# Altium schematic sheet Codec's.SchDoc: {Наименование}
size 420 x 297 mm; DocumentNumber: ВКА.821011.000.ПЗ; PageSetup: Record=PageOptions|CenterHorizontal=False|CenterVertical=False|PrintScale=0.98|XCorrection=0.00|YCorrection=0.00|PrintKind=1|BorderSize=5000000|LeftOffset=0|BottomOffset=0|Orientation=2|PaperLength=4200|PaperWidth=2970|Scale=100|PaperSource=7|PrintQuality=600|MediaType=1|DitherType=10|PrintScaleMode=1|PaperKind=A3|PaperIndex=8; Rule: PcbType=ProtelPcb
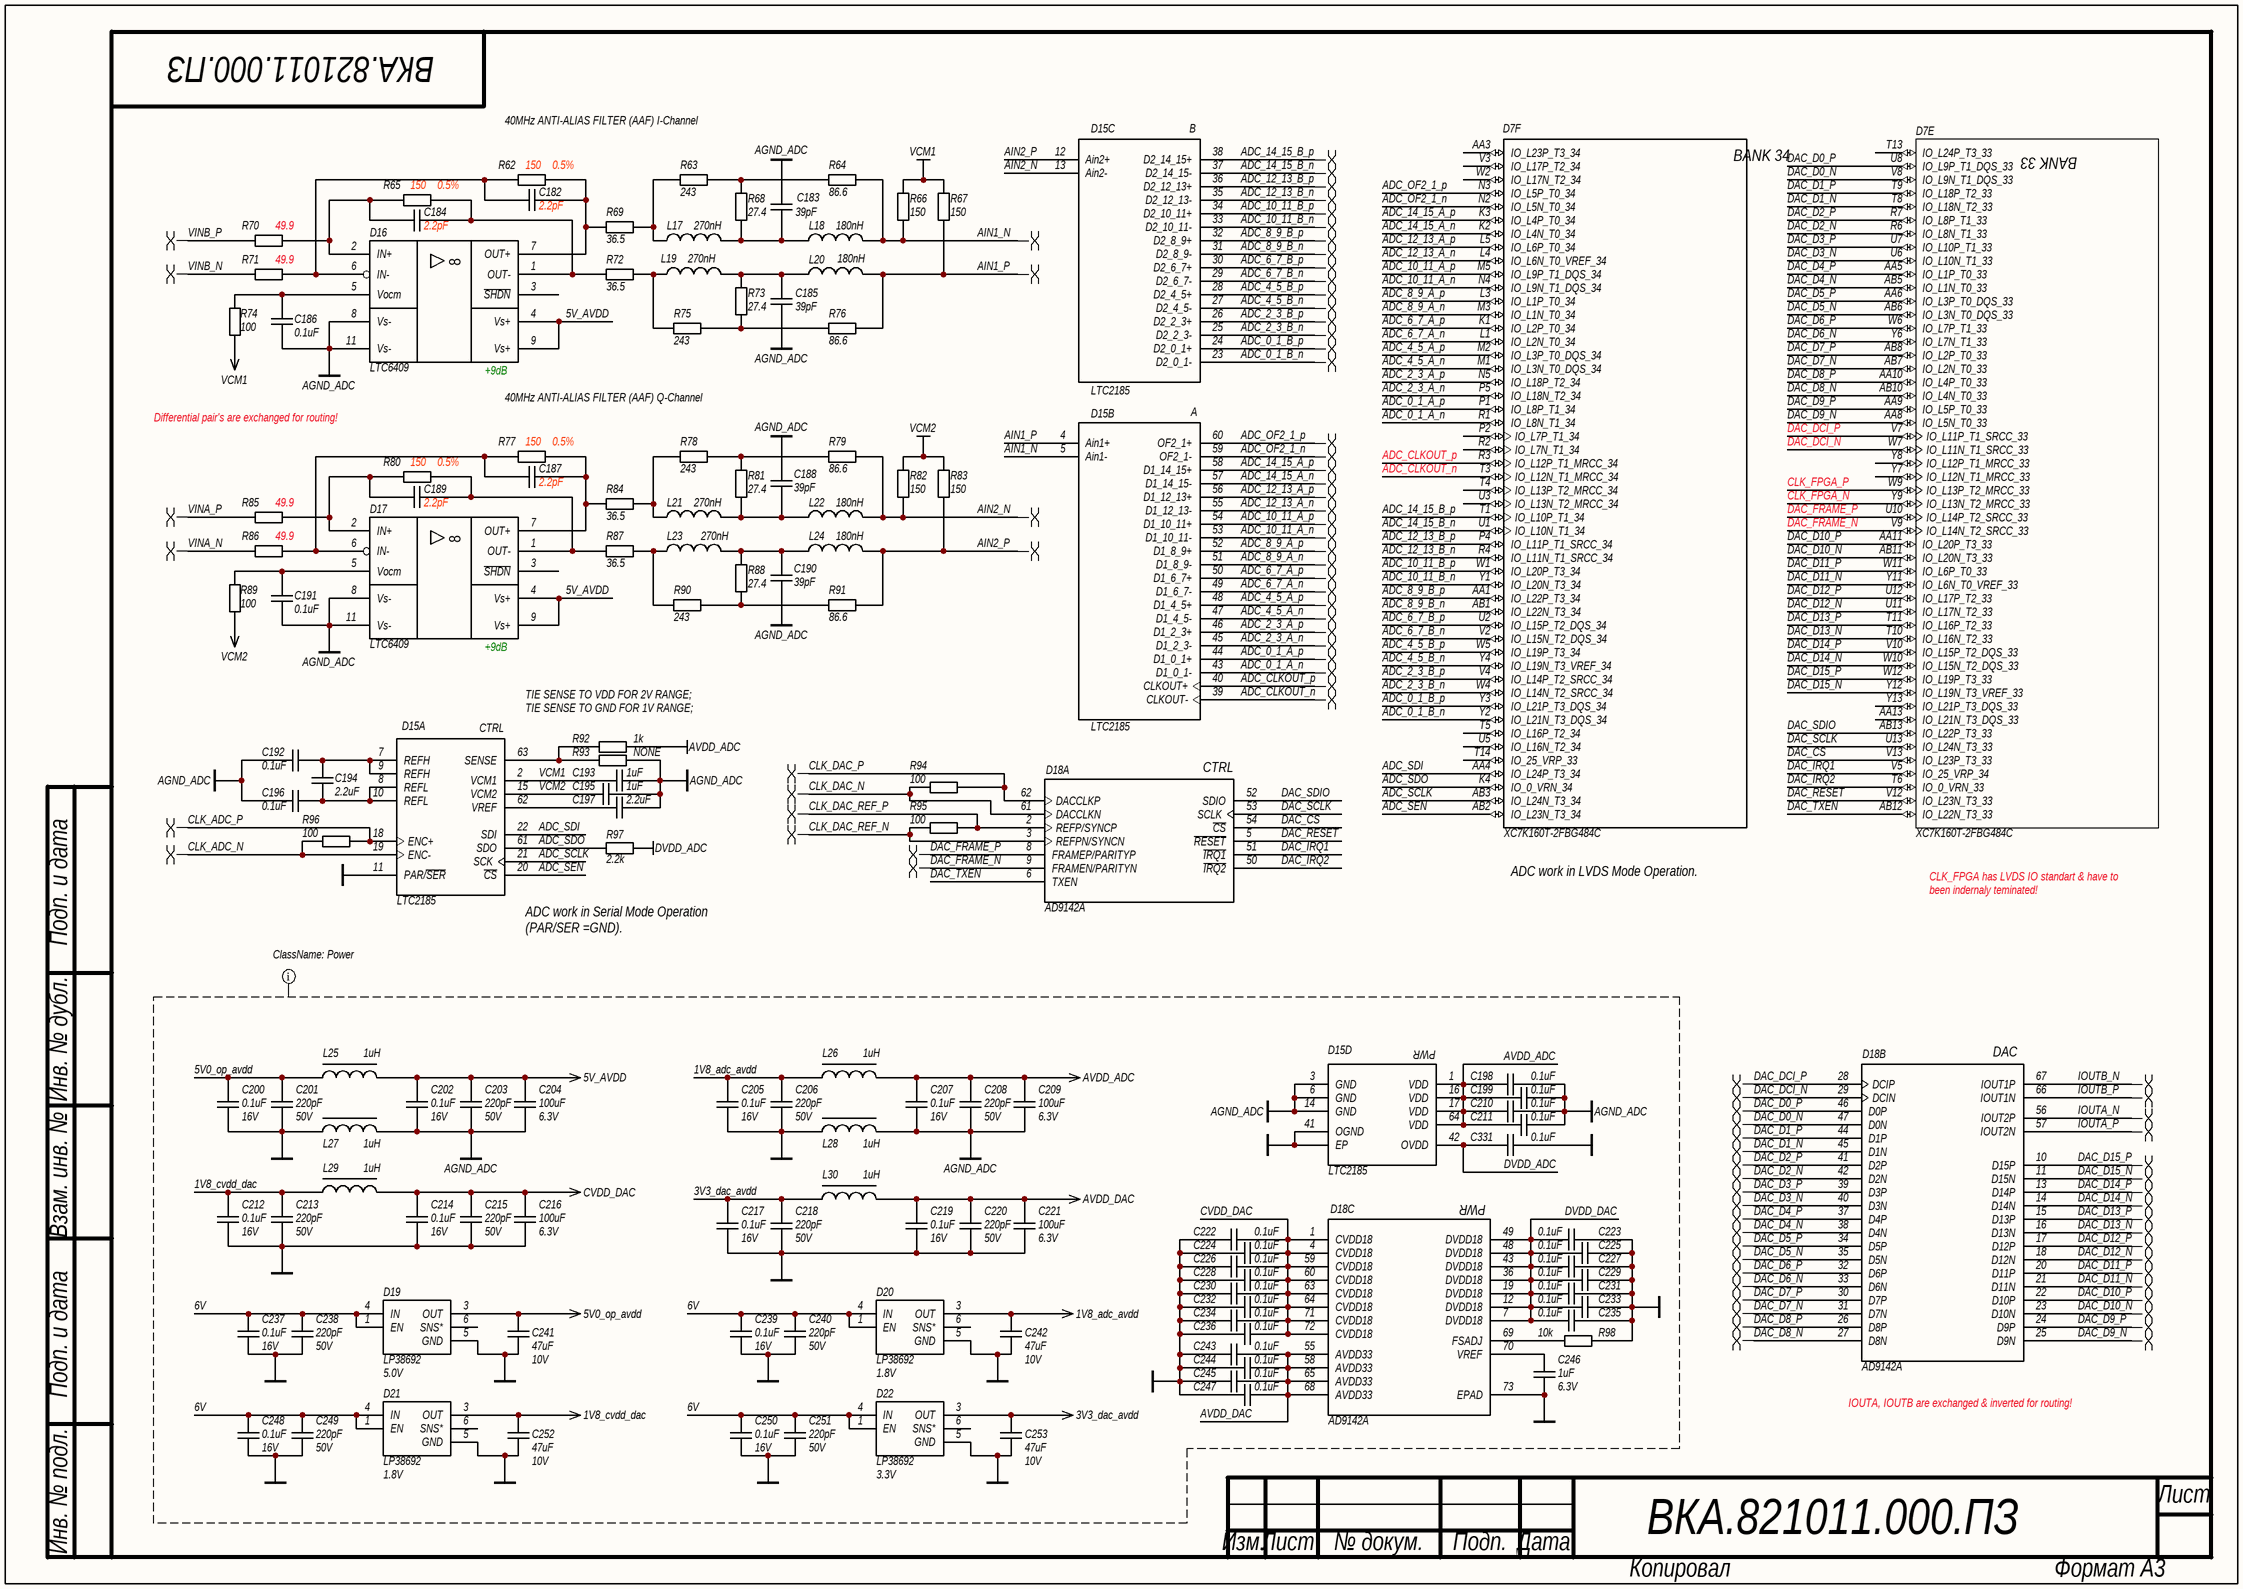
[diagram p0: Codec's.SchDoc]

## Parts
C182  value 2.2pF  [C0402]  (hidden comment: CAP)
C183  value 39pF  [C0402]  (hidden comment: CAP)
C184  value 2.2pF  [C0402]  (hidden comment: CAP)
C185  value 39pF  [C0402]  (hidden comment: CAP)
C186  value 0.1uF  [C0402]  (hidden comment: CAP)
C187  value 2.2pF  [C0402]  (hidden comment: CAP)
C188  value 39pF  [C0402]  (hidden comment: CAP)
C189  value 2.2pF  [C0402]  (hidden comment: CAP)
C190  value 39pF  [C0402]  (hidden comment: CAP)
C191  value 0.1uF  [C0402]  (hidden comment: CAP)
C192  value 0.1uF  [C0402]  (hidden comment: CAP)
C193  value 1uF  [C0402]  (hidden comment: CAP)
C194  value 2.2uF  [C0603]  (hidden comment: CAP)
C195  value 1uF  [C0402]  (hidden comment: CAP)
C196  value 0.1uF  [C0402]  (hidden comment: CAP)
C197  value 2.2uF  [C0603]  (hidden comment: CAP)
C198  value 0.1uF  [C0402]  (hidden comment: CAP)
C199  value 0.1uF  [C0402]  (hidden comment: CAP)
C200  value 0.1uF  Voltage: 16V  [C0603]  (hidden comment: CAP)
C201  value 220pF  Voltage: 50V  [C0603]  (hidden comment: CAP)
C202  value 0.1uF  Voltage: 16V  [C0603]  (hidden comment: CAP)
C203  value 220pF  Voltage: 50V  [C0603]  (hidden comment: CAP)
C204  value 100uF  Voltage: 6.3V  [C1210]  (hidden comment: CAP uF)
C205  value 0.1uF  Voltage: 16V  [C0603]  (hidden comment: CAP)
C206  value 220pF  Voltage: 50V  [C0603]  (hidden comment: CAP)
C207  value 0.1uF  Voltage: 16V  [C0603]  (hidden comment: CAP)
C208  value 220pF  Voltage: 50V  [C0603]  (hidden comment: CAP)
C209  value 100uF  Voltage: 6.3V  [C1210]  (hidden comment: CAP uF)
C210  value 0.1uF  [C0402]  (hidden comment: CAP)
C211  value 0.1uF  [C0402]  (hidden comment: CAP)
C212  value 0.1uF  Voltage: 16V  [C0603]  (hidden comment: CAP)
C213  value 220pF  Voltage: 50V  [C0603]  (hidden comment: CAP)
C214  value 0.1uF  Voltage: 16V  [C0603]  (hidden comment: CAP)
C215  value 220pF  Voltage: 50V  [C0603]  (hidden comment: CAP)
C216  value 100uF  Voltage: 6.3V  [C1210]  (hidden comment: CAP uF)
C217  value 0.1uF  Voltage: 16V  [C0603]  (hidden comment: CAP)
C218  value 220pF  Voltage: 50V  [C0603]  (hidden comment: CAP)
C219  value 0.1uF  Voltage: 16V  [C0603]  (hidden comment: CAP)
C220  value 220pF  Voltage: 50V  [C0603]  (hidden comment: CAP)
C221  value 100uF  Voltage: 6.3V  [C1210]  (hidden comment: CAP uF)
C222  value 0.1uF  [C0402]  (hidden comment: CAP)
C223  value 0.1uF  [C0402]  (hidden comment: CAP)
C224  value 0.1uF  [C0402]  (hidden comment: CAP)
C225  value 0.1uF  [C0402]  (hidden comment: CAP)
C226  value 0.1uF  [C0402]  (hidden comment: CAP)
C227  value 0.1uF  [C0402]  (hidden comment: CAP)
C228  value 0.1uF  [C0402]  (hidden comment: CAP)
C229  value 0.1uF  [C0402]  (hidden comment: CAP)
C230  value 0.1uF  [C0402]  (hidden comment: CAP)
C231  value 0.1uF  [C0402]  (hidden comment: CAP)
C232  value 0.1uF  [C0402]  (hidden comment: CAP)
C233  value 0.1uF  [C0402]  (hidden comment: CAP)
C234  value 0.1uF  [C0402]  (hidden comment: CAP)
C235  value 0.1uF  [C0402]  (hidden comment: CAP)
C236  value 0.1uF  [C0402]  (hidden comment: CAP)
C237  value 0.1uF  Voltage: 16V  [C0603]  (hidden comment: CAP)
C238  value 220pF  Voltage: 50V  [C0603]  (hidden comment: CAP)
C239  value 0.1uF  Voltage: 16V  [C0603]  (hidden comment: CAP)
C240  value 220pF  Voltage: 50V  [C0603]  (hidden comment: CAP)
C241  value 47uF  Voltage: 10V  [C1210]  (hidden comment: CAP uF)
C242  value 47uF  Voltage: 10V  [C1210]  (hidden comment: CAP uF)
C243  value 0.1uF  [C0402]  (hidden comment: CAP)
C244  value 0.1uF  [C0402]  (hidden comment: CAP)
C245  value 0.1uF  [C0402]  (hidden comment: CAP)
C246  value 1uF  Voltage: 6.3V  [C0402]  (hidden comment: CAP)
C247  value 0.1uF  [C0402]  (hidden comment: CAP)
C248  value 0.1uF  Voltage: 16V  [C0603]  (hidden comment: CAP)
C249  value 220pF  Voltage: 50V  [C0603]  (hidden comment: CAP)
C250  value 0.1uF  Voltage: 16V  [C0603]  (hidden comment: CAP)
C251  value 220pF  Voltage: 50V  [C0603]  (hidden comment: CAP)
C252  value 47uF  Voltage: 10V  [C1210]  (hidden comment: CAP uF)
C253  value 47uF  Voltage: 10V  [C1210]  (hidden comment: CAP uF)
C331  value 0.1uF  [C0402]  (hidden comment: CAP)
D7  XC7K160T-2FBG484C  [FBG484]  (parts E,F of 12)
D15  LTC2185  [QFN-64]  (parts A,B,C,D of 4)
D16  LTC6409  [QFN-10]
D17  LTC6409  [QFN-10]
D18  AD9142A  [LFCSP_VQ-72]  (parts A,B,C of 3)
D19  LP38692  Voltage: 5.0V  [SOT-223-5]
D20  LP38692  Voltage: 1.8V  [SOT-223-5]
D21  LP38692  Voltage: 1.8V  [SOT-223-5]
D22  LP38692  Voltage: 3.3V  [SOT-223-5]
L17  value 270nH  [L0603]  (hidden comment: Inductor RF)
L18  value 180nH  [L0603]  (hidden comment: Inductor RF)
L19  value 270nH  [L0603]  (hidden comment: Inductor RF)
L20  value 180nH  [L0603]  (hidden comment: Inductor RF)
L21  value 270nH  [L0603]  (hidden comment: Inductor RF)
L22  value 180nH  [L0603]  (hidden comment: Inductor RF)
L23  value 270nH  [L0603]  (hidden comment: Inductor RF)
L24  value 180nH  [L0603]  (hidden comment: Inductor RF)
L25  value 1uH  [L1210_Murata]  (hidden comment: Inductor LF)
L26  value 1uH  [L1210_Murata]  (hidden comment: Inductor LF)
L27  value 1uH  [L1210_Murata]  (hidden comment: Inductor LF)
L28  value 1uH  [L1210_Murata]  (hidden comment: Inductor LF)
L29  value 1uH  [L1210_Murata]  (hidden comment: Inductor LF)
L30  value 1uH  [L1210_Murata]  (hidden comment: Inductor LF)
R62  value 150  Tolerance: 0.5%  [R0402]  (hidden comment: RES)
R63  value 243  [R0402]  (hidden comment: RES)
R64  value 86.6  [R0402]  (hidden comment: RES)
R65  value 150  Tolerance: 0.5%  [R0402]  (hidden comment: RES)
R66  value 150  [R0402]  (hidden comment: RES)
R67  value 150  [R0402]  (hidden comment: RES)
R68  value 27.4  [R0402]  (hidden comment: RES)
R69  value 36.5  [R0402]  (hidden comment: RES)
R70  value 49.9  [R0402]  (hidden comment: RES)
R71  value 49.9  [R0402]  (hidden comment: RES)
R72  value 36.5  [R0402]  (hidden comment: RES)
R73  value 27.4  [R0402]  (hidden comment: RES)
R74  value 100  [R0402]  (hidden comment: RES)
R75  value 243  [R0402]  (hidden comment: RES)
R76  value 86.6  [R0402]  (hidden comment: RES)
R77  value 150  Tolerance: 0.5%  [R0402]  (hidden comment: RES)
R78  value 243  [R0402]  (hidden comment: RES)
R79  value 86.6  [R0402]  (hidden comment: RES)
R80  value 150  Tolerance: 0.5%  [R0402]  (hidden comment: RES)
R81  value 27.4  [R0402]  (hidden comment: RES)
R82  value 150  [R0402]  (hidden comment: RES)
R83  value 150  [R0402]  (hidden comment: RES)
R84  value 36.5  [R0402]  (hidden comment: RES)
R85  value 49.9  [R0402]  (hidden comment: RES)
R86  value 49.9  [R0402]  (hidden comment: RES)
R87  value 36.5  [R0402]  (hidden comment: RES)
R88  value 27.4  [R0402]  (hidden comment: RES)
R89  value 100  [R0402]  (hidden comment: RES)
R90  value 243  [R0402]  (hidden comment: RES)
R91  value 86.6  [R0402]  (hidden comment: RES)
R92  value 1k  [R0402]  (hidden comment: RES)
R93  value NONE  [R0402]  (hidden comment: RES)
R94  value 100  [R0402]  (hidden comment: RES)
R95  value 100  [R0402]  (hidden comment: RES)
R96  value 100  [R0402]  (hidden comment: RES)
R97  value 2.2k  [R0402]  (hidden comment: RES)
R98  value 10k  [R0402]  (hidden comment: RES)

## Nets
1V8_adc_avdd: C205.2 C206.2 C242.2 D20.3(OUT) L26.1
1V8_cvdd_dac: C212.2 C213.2 C252.2 D21.3(OUT) L29.1
3V3_dac_avdd: C217.2 C218.2 C253.2 D22.3(OUT) L30.1
5V0_op_avdd: C200.2 C201.2 C241.2 D19.3(OUT) L25.1
5V_AVDD: C202.2 C203.2 C204.2 D16.4(Vs+) D16.9(Vs+) D17.4(Vs+) D17.9(Vs+) L25.2
AGND_ADC: C183.1 C185.2 C186.1 C188.1 C190.2 C191.1 C192.2 C193.1 C195.1 C196.2 C197.1 C198.2 C199.2 C202.1 C203.1 C204.1 C207.1 C208.1 C209.1 C210.2 C211.2 D15.3(GND) D15.6(GND) D15.14(GND) D16.8(Vs-) D16.11(Vs-) D17.8(Vs-) D17.11(Vs-) L27.2 L28.2 R93.2
AVDD_ADC: C198.1 C199.1 C207.2 C208.2 C209.2 C210.1 C211.1 D15.1(VDD) D15.16(VDD) D15.17(VDD) D15.64(VDD) L26.2 R92.2
AVDD_DAC: C219.2 C220.2 C221.2 C243.2 C244.2 C245.2 C247.2 D18.55(AVDD33) D18.58(AVDD33) D18.65(AVDD33) D18.68(AVDD33) L30.2
CVDD_DAC: C214.2 C215.2 C216.2 C222.2 C224.2 C226.2 C228.2 C230.2 C232.2 C234.2 C236.2 D18.1(CVDD18) D18.4(CVDD18) D18.59(CVDD18) D18.60(CVDD18) D18.63(CVDD18) D18.64(CVDD18) D18.71(CVDD18) D18.72(CVDD18) L29.2
DVDD_ADC: C331.1 D15.42(OVDD) R97.1
GND: C200.1 C201.1 C205.1 C206.1 C212.1 C213.1 C214.1 C215.1 C216.1 C217.1 C218.1 C219.1 C220.1 C221.1 C222.1 C223.2 C224.1 C225.2 C226.1 C227.2 C228.1 C229.2 C230.1 C231.2 C232.1 C233.2 C234.1 C235.2 C236.1 C237.1 C238.1 C239.1 C240.1 C241.1 C242.1 C243.1 C244.1 C245.1 C246.1 C247.1 C248.1 C249.1 C250.1 C251.1 C252.1 C253.1 C331.2 D15.0(EP) D15.11(PAR/~{SER}) D15.41(OGND) D18.73(EPAD) D19.5(GND) D20.5(GND) D21.5(GND) D22.5(GND) L27.1 L28.1 R98.2
VCM1: C193.2 D15.2(VCM1) R66.2 R67.1 R74.2
VCM2: C195.2 D15.15(VCM2) R82.1 R83.1 R89.2
6V: C237.2 C238.2 C239.2 C240.2 C248.2 C249.2 C250.2 C251.2 D19.1(EN) D19.4(IN) D20.1(EN) D20.4(IN) D21.1(EN) D21.4(IN) D22.1(EN) D22.4(IN)
ADC_0_1_A_n: D7.R1(IO_L8N_T1_34) D15.43(D1_0_1-)
ADC_0_1_A_p: D7.P1(IO_L8P_T1_34) D15.44(D1_0_1+)
ADC_0_1_B_n: D7.Y2(IO_L21N_T3_DQS_34) D15.23(D2_0_1-)
ADC_0_1_B_p: D7.Y3(IO_L21P_T3_DQS_34) D15.24(D2_0_1+)
ADC_2_3_A_n: D7.P5(IO_L18N_T2_34) D15.45(D1_2_3-)
ADC_2_3_A_p: D7.N5(IO_L18P_T2_34) D15.46(D1_2_3+)
ADC_2_3_B_n: D7.W4(IO_L14N_T2_SRCC_34) D15.25(D2_2_3-)
ADC_2_3_B_p: D7.V4(IO_L14P_T2_SRCC_34) D15.26(D2_2_3+)
ADC_4_5_A_n: D7.M1(IO_L3N_T0_DQS_34) D15.47(D1_4_5-)
ADC_4_5_A_p: D7.M2(IO_L3P_T0_DQS_34) D15.48(D1_4_5+)
ADC_4_5_B_n: D7.Y4(IO_L19N_T3_VREF_34) D15.27(D2_4_5-)
ADC_4_5_B_p: D7.W5(IO_L19P_T3_34) D15.28(D2_4_5+)
ADC_6_7_A_n: D7.L1(IO_L2N_T0_34) D15.49(D1_6_7-)
ADC_6_7_A_p: D7.K1(IO_L2P_T0_34) D15.50(D1_6_7+)
ADC_6_7_B_n: D7.V2(IO_L15N_T2_DQS_34) D15.29(D2_6_7-)
ADC_6_7_B_p: D7.U2(IO_L15P_T2_DQS_34) D15.30(D2_6_7+)
ADC_8_9_A_n: D7.M3(IO_L1N_T0_34) D15.51(D1_8_9-)
ADC_8_9_A_p: D7.L3(IO_L1P_T0_34) D15.52(D1_8_9+)
ADC_8_9_B_n: D7.AB1(IO_L22N_T3_34) D15.31(D2_8_9-)
ADC_8_9_B_p: D7.AA1(IO_L22P_T3_34) D15.32(D2_8_9+)
ADC_10_11_A_n: D7.N4(IO_L9N_T1_DQS_34) D15.53(D1_10_11-)
ADC_10_11_A_p: D7.M5(IO_L9P_T1_DQS_34) D15.54(D1_10_11+)
ADC_10_11_B_n: D7.Y1(IO_L20N_T3_34) D15.33(D2_10_11-)
ADC_10_11_B_p: D7.W1(IO_L20P_T3_34) D15.34(D2_10_11+)
ADC_12_13_A_n: D7.L4(IO_L6N_T0_VREF_34) D15.55(D1_12_13-)
ADC_12_13_A_p: D7.L5(IO_L6P_T0_34) D15.56(D1_12_13+)
ADC_12_13_B_n: D7.R4(IO_L11N_T1_SRCC_34) D15.35(D2_12_13-)
ADC_12_13_B_p: D7.P4(IO_L11P_T1_SRCC_34) D15.36(D2_12_13+)
ADC_14_15_A_n: D7.K2(IO_L4N_T0_34) D15.57(D1_14_15-)
ADC_14_15_A_p: D7.K3(IO_L4P_T0_34) D15.58(D1_14_15+)
ADC_14_15_B_n: D7.U1(IO_L10N_T1_34) D15.37(D2_14_15-)
ADC_14_15_B_p: D7.T1(IO_L10P_T1_34) D15.38(D2_14_15+)
ADC_CLKOUT_n: D7.T3(IO_L12N_T1_MRCC_34) D15.39(CLKOUT-)
ADC_CLKOUT_p: D7.R3(IO_L12P_T1_MRCC_34) D15.40(CLKOUT+)
ADC_OF2_1_n: D7.N2(IO_L5N_T0_34) D15.59(OF2_1-)
ADC_OF2_1_p: D7.N3(IO_L5P_T0_34) D15.60(OF2_1+)
ADC_SCLK: D7.AB3(IO_L24N_T3_34) D15.21(SCK)
ADC_SDI: D7.AA4(IO_L24P_T3_34) D15.22(SDI)
ADC_SDO: D7.K4(IO_0_VRN_34) D15.61(SDO) R97.2
ADC_SEN: D7.AB2(IO_L23N_T3_34) D15.20(~{CS})
AIN1_N: D15.5(Ain1-) L18.2 R64.2 R66.1
AIN1_P: D15.4(Ain1+) L20.2 R67.2 R76.2
AIN2_N: D15.13(Ain2-) L22.2 R79.2 R82.2
AIN2_P: D15.12(Ain2+) L24.2 R83.2 R91.2
CLK_ADC_N: D15.19(ENC-) R96.1
CLK_ADC_P: D15.18(ENC+) R96.2
CLK_DAC_N: D18.61(DACCLKN) R94.1
CLK_DAC_P: D18.62(DACCLKP) R94.2
CLK_DAC_REF_N: D18.3(REFPN/SYNCN) R95.1
CLK_DAC_REF_P: D18.2(REFP/SYNCP) R95.2
CLK_FPGA_N: D7.Y9(IO_L13N_T2_MRCC_33)
CLK_FPGA_P: D7.W9(IO_L13P_T2_MRCC_33)
DAC_CS: D7.V13(IO_L23P_T3_33) D18.54(~{CS})
DAC_D0_N: D7.V8(IO_L9N_T1_DQS_33) D18.47(D0N)
DAC_D0_P: D7.U8(IO_L9P_T1_DQS_33) D18.46(D0P)
DAC_D1_N: D7.T8(IO_L18N_T2_33) D18.45(D1N)
DAC_D1_P: D7.T9(IO_L18P_T2_33) D18.44(D1P)
DAC_D2_N: D7.R6(IO_L8N_T1_33) D18.42(D2N)
DAC_D2_P: D7.R7(IO_L8P_T1_33) D18.41(D2P)
DAC_D3_N: D7.U6(IO_L10N_T1_33) D18.40(D3N)
DAC_D3_P: D7.U7(IO_L10P_T1_33) D18.39(D3P)
DAC_D4_N: D7.AB5(IO_L1N_T0_33) D18.38(D4N)
DAC_D4_P: D7.AA5(IO_L1P_T0_33) D18.37(D4P)
DAC_D5_N: D7.AB6(IO_L3N_T0_DQS_33) D18.35(D5N)
DAC_D5_P: D7.AA6(IO_L3P_T0_DQS_33) D18.34(D5P)
DAC_D6_N: D7.Y6(IO_L7N_T1_33) D18.33(D6N)
DAC_D6_P: D7.W6(IO_L7P_T1_33) D18.32(D6P)
DAC_D7_N: D7.AB7(IO_L2N_T0_33) D18.31(D7N)
DAC_D7_P: D7.AB8(IO_L2P_T0_33) D18.30(D7P)
DAC_D8_N: D7.AB10(IO_L4N_T0_33) D18.27(D8N)
DAC_D8_P: D7.AA10(IO_L4P_T0_33) D18.26(D8P)
DAC_D9_N: D7.AA8(IO_L5N_T0_33) D18.25(D9N)
DAC_D9_P: D7.AA9(IO_L5P_T0_33) D18.24(D9P)
DAC_D10_N: D7.AB11(IO_L20N_T3_33) D18.23(D10N)
DAC_D10_P: D7.AA11(IO_L20P_T3_33) D18.22(D10P)
DAC_D11_N: D7.Y11(IO_L6N_T0_VREF_33) D18.21(D11N)
DAC_D11_P: D7.W11(IO_L6P_T0_33) D18.20(D11P)
DAC_D12_N: D7.U11(IO_L17N_T2_33) D18.18(D12N)
DAC_D12_P: D7.U12(IO_L17P_T2_33) D18.17(D12P)
DAC_D13_N: D7.T10(IO_L16N_T2_33) D18.16(D13N)
DAC_D13_P: D7.T11(IO_L16P_T2_33) D18.15(D13P)
DAC_D14_N: D7.W10(IO_L15N_T2_DQS_33) D18.14(D14N)
DAC_D14_P: D7.V10(IO_L15P_T2_DQS_33) D18.13(D14P)
DAC_D15_N: D7.Y12(IO_L19N_T3_VREF_33) D18.11(D15N)
DAC_D15_P: D7.W12(IO_L19P_T3_33) D18.10(D15P)
DAC_DCI_N: D7.W7(IO_L11N_T1_SRCC_33) D18.29(DCIN)
DAC_DCI_P: D7.V7(IO_L11P_T1_SRCC_33) D18.28(DCIP)
DAC_FRAME_N: D7.V9(IO_L14N_T2_SRCC_33) D18.9(FRAMEN/PARITYN)
DAC_FRAME_P: D7.U10(IO_L14P_T2_SRCC_33) D18.8(FRAMEP/PARITYP)
DAC_IRQ1: D7.V5(IO_25_VRP_34) D18.51(~{IRQ1})
DAC_IRQ2: D7.T6(IO_0_VRN_33) D18.50(~{IRQ2})
DAC_RESET: D7.V12(IO_L23N_T3_33) D18.5(~{RESET})
DAC_SCLK: D7.U13(IO_L24N_T3_33) D18.53(SCLK)
DAC_SDIO: D7.AB13(IO_L22P_T3_33) D18.52(SDIO)
DAC_TXEN: D7.AB12(IO_L22N_T3_33) D18.6(TXEN)
DVDD_DAC: C223.1 C225.1 C227.1 C229.1 C231.1 C233.1 C235.1 D18.7(DVDD18) D18.12(DVDD18) D18.19(DVDD18) D18.36(DVDD18) D18.43(DVDD18) D18.48(DVDD18) D18.49(DVDD18)
IOUTA_N: D18.56(IOUT2P)
IOUTA_P: D18.57(IOUT2N)
IOUTB_N: D18.67(IOUT1P)
IOUTB_P: D18.66(IOUT1N)
VINA_N: R86.2
VINA_P: R85.2
VINB_N: R71.2
VINB_P: R70.2
NetC182_1: C182.1 D16.6(IN-) R62.1 R71.1
NetC182_2: C182.2 D16.7(OUT+) R62.2 R69.2
NetC183_2: C183.2 L17.2 L18.1 R68.2
NetC184_1: C184.1 D16.2(IN+) R65.1 R70.1
NetC184_2: C184.2 D16.1(OUT-) R65.2 R72.2
NetC185_1: C185.1 L19.2 L20.1 R73.1
NetC186_2: C186.2 D16.5(Vocm) R74.1
NetC187_1: C187.1 D17.6(IN-) R77.1 R86.1
NetC187_2: C187.2 D17.7(OUT+) R77.2 R84.2
NetC188_2: C188.2 L21.2 L22.1 R81.2
NetC189_1: C189.1 D17.2(IN+) R80.1 R85.1
NetC189_2: C189.2 D17.1(OUT-) R80.2 R87.2
NetC190_1: C190.1 L23.2 L24.1 R88.1
NetC191_2: C191.2 D17.5(Vocm) R89.1
NetC192_1: C192.1 C194.1 D15.7(REFH) D15.9(REFH)
NetC194_2: C194.2 C196.1 D15.8(REFL) D15.10(REFL)
NetC197_2: C197.2 D15.62(VREF)
NetC246_2: C246.2 D18.70(VREF)
NetD15_63: D15.63(SENSE) R92.1 R93.1
NetD18_69: D18.69(FSADJ) R98.1
NetL17_1: L17.1 R63.1 R69.1
NetL19_1: L19.1 R72.1 R75.1
NetL21_1: L21.1 R78.1 R84.1
NetL23_1: L23.1 R87.1 R90.1
NetR63_2: R63.2 R64.1 R68.1
NetR73_2: R73.2 R75.2 R76.1
NetR78_2: R78.2 R79.1 R81.1
NetR88_2: R88.2 R90.2 R91.1

Not connected (* = marked no-connect by the designer): D7 AA3(IO_L23P_T3_34) AA13(IO_L21N_T3_DQS_33) P2(IO_L7P_T1_34) R2(IO_L7N_T1_34) T4(IO_L13P_T2_MRCC_34) T5(IO_L16P_T2_34) T13(IO_L24P_T3_33) T14(IO_25_VRP_33) U3(IO_L13N_T2_MRCC_34) U5(IO_L16N_T2_34) V3(IO_L17P_T2_34) W2(IO_L17N_T2_34) Y7(IO_L12N_T1_MRCC_33) Y8(IO_L12P_T1_MRCC_33) Y13(IO_L21P_T3_DQS_33); D16 3(~{SHDN}); D17 3(~{SHDN}); D19 6(SNS*); D20 6(SNS*); D21 6(SNS*); D22 6(SNS*)

## Layout directives
differential pair: ADC_0_1_A_n, ADC_0_1_A_p, ADC_0_1_B_n, ADC_0_1_B_p, ADC_2_3_A_n, ADC_2_3_A_p, ADC_2_3_B_n, ADC_2_3_B_p, ADC_4_5_A_n, ADC_4_5_A_p, ADC_4_5_B_n, ADC_4_5_B_p, ADC_6_7_A_n, ADC_6_7_A_p, ADC_6_7_B_n, ADC_6_7_B_p, ADC_8_9_A_n, ADC_8_9_A_p, ADC_8_9_B_n, ADC_8_9_B_p, ADC_10_11_A_n, ADC_10_11_A_p, ADC_10_11_B_n, ADC_10_11_B_p, ADC_12_13_A_n, ADC_12_13_A_p, ADC_12_13_B_n, ADC_12_13_B_p, ADC_14_15_A_n, ADC_14_15_A_p, ADC_14_15_B_n, ADC_14_15_B_p, ADC_CLKOUT_n, ADC_CLKOUT_p, ADC_OF2_1_n, ADC_OF2_1_p, AIN1_N, AIN1_P, AIN2_N, AIN2_P, CLK_ADC_N, CLK_ADC_P, CLK_DAC_N, CLK_DAC_P, CLK_DAC_REF_N, CLK_DAC_REF_P, DAC_D0_N, DAC_D0_P, DAC_D1_N, DAC_D1_P, DAC_D2_N, DAC_D2_P, DAC_D3_N, DAC_D3_P, DAC_D4_N, DAC_D4_P, DAC_D5_N, DAC_D5_P, DAC_D6_N, DAC_D6_P, DAC_D7_N, DAC_D7_P, DAC_D8_N, DAC_D8_P, DAC_D9_N, DAC_D9_P, DAC_D10_N, DAC_D10_P, DAC_D11_N, DAC_D11_P, DAC_D12_N, DAC_D12_P, DAC_D13_N, DAC_D13_P, DAC_D14_N, DAC_D14_P, DAC_D15_N, DAC_D15_P, DAC_DCI_N, DAC_DCI_P, DAC_FRAME_N, DAC_FRAME_P, IOUTA_N, IOUTA_P, IOUTB_N, IOUTB_P, VINA_N, VINA_P, VINB_N, VINB_P
net class Power: 1V8_adc_avdd, 1V8_cvdd_dac, 3V3_dac_avdd, 5V0_op_avdd, 5V_AVDD, 6V, AGND_ADC, AVDD_ADC, AVDD_DAC, CVDD_DAC, DVDD_ADC, DVDD_DAC, GND

## Notes on the sheet
- 40MHz ANTI-ALIAS FILTER (AAF) I-Channel
- (near D16) +9dB
- Differential pair's are exchanged for routing!
- 40MHz ANTI-ALIAS FILTER (AAF) Q-Channel
- (near D17) +9dB
- TIE SENSE TO VDD FOR 2V RANGE;
  TIE SENSE TO GND FOR 1V RANGE;
- ADC work in Serial Mode Operation (PAR/SER =GND).
- (near D7) ADC work in LVDS Mode Operation.
- CLK_FPGA has LVDS IO standart & have to been indernaly teminated!
- IOUTA, IOUTB are exchanged & inverted for routing!
- Подп. и дата
- Инв. № дубл.
- Взам. инв. №
- Инв. № подл.
- Лист
- Изм.
- № докум.
- Подп.
- Дата
- Копировал
- Формат А3
- (in symbol AD9142A, part A) CTRL
- (in symbol AD9142A, part B) DAC
- (in symbol AD9142A, part C) PWR
- (in symbol LTC2185, part A) CTRL
- (in symbol LTC2185, part B) A
- (in symbol LTC2185, part C) B
- (in symbol LTC2185, part D) PWR
- (in symbol XC7K160T-2FBG484C, part E) BANK 33
- (in symbol XC7K160T-2FBG484C, part F) BANK 34

## Library data of the parts
C182 C184 C187 C189 = CAP: SMD Capacitor; Manufacturer: Murata; Material: NP0; Tolerance: 0.1pF; Voltage: 25V; Type: Ceramic Capacitor; P/N: GRM1555C1E2R2BA01D
C183 C185 C188 C190 = CAP: SMD Capacitor; Manufacturer: Murata; Material: NP0; Tolerance: 1%; Voltage: 50V; Type: Ceramic Capacitor; P/N: GRM1555C1H390FA01D
C186 C191 C192 C196 = CAP: SMD Capacitor; Manufacturer: Murata; Material: X7R; Tolerance: 10%; Voltage: 50V; Type: Ceramic Capacitor; P/N: GRM155R71H104KE14J
C193 C195 = CAP: SMD Capacitor; Manufacturer: Murata; Material: X7R; Tolerance: 10%; Voltage: 6.3V; Type: Ceramic Capacitor; P/N: GRM155R70J105KA12D
C194 C197 = CAP: SMD Capacitor; Manufacturer: Murata; Material: X7R; Tolerance: 10%; Voltage: 10V; Type: Ceramic Capacitor; P/N: GRM188R71A225KE15D
C198 C199 C210 C211 C222-C236 C243-C245 C247 C331 = CAP: SMD Capacitor; Manufacturer: Murata; Material: X7R; Tolerance: 10%; Voltage: 16V; Type: Ceramic Capacitor; P/N: GRM155R71C104KA88J
C200 C202 C205 C207 C212 C214 C217 C219 C237 C239 C248 C250 = CAP: SMD Capacitor; Manufacturer: Murata; Material: X7R; Tolerance: 10%; Type: Ceramic Capacitor; P/N: GRM188R71C104KA01D
C201 C203 C206 C208 C213 C215 C218 C220 C238 C240 C249 C251 = CAP: SMD Capacitor; Manufacturer: Murata; Material: X7R; Tolerance: 10%; Type: Ceramic Capacitor; P/N: GRM188R71H221KA01D
C204 C209 C216 C221 = CAP uF: SMD Capacitor; Manufacturer: Murata; Material: X5R; Tolerance: 20%; Type: Ceramic Capacitor; P/N: GRM32ER60J107ME20L
C241 C242 C252 C253 = CAP uF: SMD Capacitor; Manufacturer: Murata; Material: X7R; Tolerance: 10%; Type: Ceramic Capacitor; P/N: GRM32ER71A476KE15L
C246 = CAP: SMD Capacitor; Manufacturer: Murata; Material: X7R; Tolerance: 10%; Type: Ceramic Capacitor; P/N: GRM155R70J105KA12D
D7 = XC7K160T-2FBG484C: Xilinx 7-Series FPGA; Speed Grade: -2; Manufacturer: Xilinx; Name: XC7K160T-2FBG484C; Series: 7-Series FPGA; Package: 484 Ball FBG
D15 = LTC2185: Dual 16-Bit, 125Msps  Low Power 3V ADC; Name: LTC2185CUP#PBF-ND; Power Dissipation: 370mW; Resolution: 16 Bits; Sampling Frequency: 125 MHz; Type: Dual 16-Bit, 105Msps  Low Power 3V ADC; Voltage: Single 1.8V Supply; Package: 64-Pin (9mm × 9mm) QFN; Temperature Range: 0°C to 70°C
D16 D17 = LTC6409: Differential Amplifier/ADC   Driver; Manufacturer: Linear Technology; Name: LTC6409CUDB#TRMPBF; Voltage: 2.7V to 5.25V; Type: Very high speed, low distortion, differential amplifier.; Package: 10-Lead 3mm ×2mm ×0.75mm QFN; Temperature Range: –40°C to 125°C
D18 = AD9142A: Dual, 16-Bit, 1600 MSPS, TxDAC+   Digital-to-Analog Converter; Name: AD9142ABCPZ; Power Dissipation: 1.5 W at 1.25 GSPS; Resolution: 16 bit; Sampling Frequency: 575 MHz; Voltage: 3.3V, 1.8V; Package: 72-lead LFCSP; Temperature Range: −40°C to +85°C; Type: Dual, 16-Bit, 1600 MSPS, TxDAC+   Digital-to-Analog Converter
D19 = LP38692: Linear Regulator; P/N: LP38692MP-5.0/NOPB
D20 D21 = LP38692: Linear Regulator; P/N: LP38692MP-1.8/NOPB
D22 = LP38692: Linear Regulator; P/N: LP38692MP-3.3/NOPB
L17 L19 L21 L23 = Inductor RF: Chip SMD Inductor; Manufacturer: Murata; Current: 250mA; Frequency: 1.25GHz; Name: LQW18; Tolerance: ±2%; P/N: LQW18ANR27G80D; Series: LQW; Temperature Range: -25…85°C
L18 L20 L22 L24 = Inductor RF: Chip SMD Inductor; Manufacturer: Murata; Current: 250mA; Frequency: 1.35GHz; Name: LQW18; Tolerance: ±2%; P/N: LQW18ANR18G80D; Series: LQW; Temperature Range: -25…85°C
L25-L30 = Inductor LF: Inductor Power Lines; Manufacturer: Murata; Name: LQM32PN1R0MG0; Current: 2500mA; Tolerance: 5%; Frequency: 100MHz; Temperature Range: -25ºC to 85ºC; P/N: LQM32PN1R0MG0
  L25-L27: Series: LQM
  L28 L30: Series: LQM32
  L29: Series: LQH
R62 R65 R77 R80 = RES: SMD Resistor; Manufacturer: Panasonic Electronic Components; Name: Chip SMD Resistor; Power: 0.062 Wt; P/N: ERJ-2RHD1500X; Temperature Range: -55…155°C
R63 R75 R78 R90 = RES: SMD Resistor; Manufacturer: Panasonic Electronic Components; Name: Chip SMD Resistor; Power: 0.062 Wt; Tolerance: 1%; P/N: ERJ-2RKF2430X; Temperature Range: -55…155°C
R64 R76 R79 R91 = RES: SMD Resistor; Manufacturer: Panasonic Electronic Components; Name: Chip SMD Resistor; Power: 0.062 Wt; Tolerance: 1%; P/N: ERJ-2RKF86R6X; Temperature Range: -55…155°C
R66 R67 R82 R83 = RES: SMD Resistor; Manufacturer: Panasonic Electronic Components; Name: Chip SMD Resistor; Power: 0.062 Wt; Tolerance: 1%; P/N: ERJ-2RKF1500X; Temperature Range: -55…155°C
R68 R73 R81 R88 = RES: SMD Resistor; Manufacturer: Panasonic Electronic Components; Name: Chip SMD Resistor; Power: 0.062 Wt; Tolerance: 1%; P/N: ERJ-2RKF27R4X; Temperature Range: -55…155°C
R69 R72 R84 R87 = RES: SMD Resistor; Manufacturer: Panasonic Electronic Components; Name: Chip SMD Resistor; Power: 0.062 Wt; Tolerance: 1%; P/N: ERJ-2RKF36R5X; Temperature Range: -55…155°C
R70 R71 R85 R86 = RES: SMD Resistor; Manufacturer: Panasonic Electronic Components; Name: Chip SMD Resistor; Power: 0.063 Wt; Tolerance: 0.5%; P/N: ERJ-2RKD49R9X; Temperature Range: -55…155°C
R74 R89 R94-R96 = RES: SMD Resistor; Manufacturer: Panasonic Electronic Components; Name: Chip SMD Resistor; Power: 0.062 Wt; Tolerance: 5%; P/N: ERJ-2GEJ101X; Temperature Range: -55…155°C
R92 = RES: SMD Resistor; Manufacturer: Panasonic Electronic Components; Name: Chip SMD Resistor; Power: 0.062 Wt; Tolerance: 5%; P/N: ERJ-2GEJ102X; Temperature Range: -55…155°C
R93 = RES: SMD Resistor; Manufacturer: Panasonic Electronic Components; Name: Chip SMD Resistor; Power: 0.062 Wt; P/N: ERJ-2GE0R00X; Temperature Range: -55…155°C
R97 = RES: SMD Resistor; Name: Chip SMD Resistor; Power: 0.062 Wt; Tolerance: 5%; P/N: ERJ-2GEJ222X; Temperature Range: -55…155°C
R98 = RES: SMD Resistor; Manufacturer: Panasonic Electronic Components; Name: Chip SMD Resistor; Power: 0.062 Wt; Tolerance: 5%; P/N: ERJ-2GEJ103X; Temperature Range: -55…155°C